# Altium schematic sheet cs301_Team01_Schematic_Sensor.SchDoc: Sensor Processing
size A4; Date: 06/08/2023; DrawnBy: Viktor Neshikj; Revision: 1.0; SheetNumber: 2; SheetTotal: 2
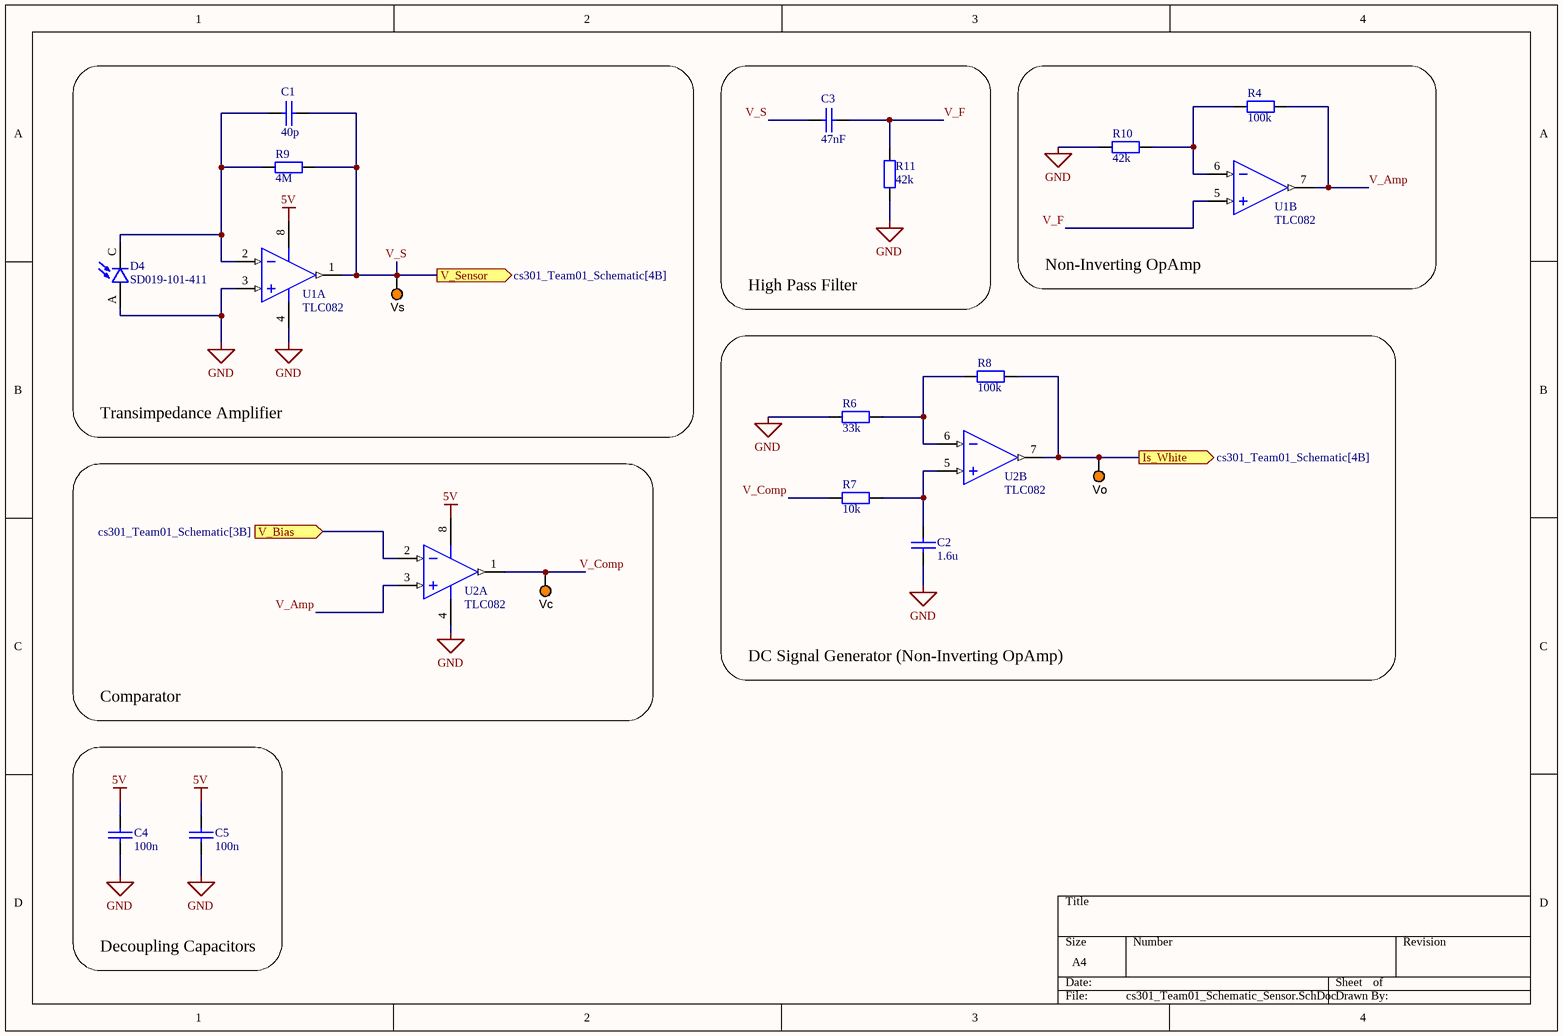
[diagram p0: cs301_Team01_Schematic_Sensor.SchDoc]

## Parts
C1  40p  [0805 CAP]
C2  1.6u  [0805 CAP]
C3  47nF  [0805 CAP]
C4  100n  [0805 CAP]
C5  100n  [0805 CAP]
D4  SD019-101-411  [XDCR_TEMD7000X01]
R4  100k  [0805 RES]
R6  33k  [0805 RES]
R7  10k  [0805 RES]
R8  100k  [0805 RES]
R9  4M  [0805 RES]
R10  42k  [0805 RES]
R11  42k  [0805 RES]
U1  TLC082  [SO - 8]  (parts A,B of 2)
U2  TLC082  [SO - 8]  (parts A,B of 2)
Vc  5003  [TP_TH]  (value not drawn)
Vo  5003  [TP_TH]  (value not drawn)
Vs  5003  [TP_TH]  (value not drawn)

## Blocks framed on the sheet
Transimpedance Amplifier: C1 D4 R9 U1 Vs
High Pass Filter: C3 R11
Non-Inverting OpAmp: R4 R10 U1
DC Signal Generator (Non-Inverting OpAmp): C2 R6-R8 U2 Vo
Comparator: U2 Vc
Decoupling Capacitors: C4 C5

## Ports
Is_White (out, see cs301_Team01_Schematic[4B]), V_Bias (in, see cs301_Team01_Schematic[3B]), V_Sensor (out, see cs301_Team01_Schematic[4B])

## Nets
5V: C4.1 C5.1 U1.8(VDD) U2.8(VDD)
GND: C2.1 C4.2 C5.2 D4.A R6.2 R10.1 R11.1 U1.3(VINA+) U1.4(VSS) U2.4(VSS)
Is_White: R8.1 U2.7(VOUTA) Vo.1 ; port Is_White
V_Amp: R4.2 U1.7(VOUTA) U2.3(VINA+)
V_Bias: U2.2(VINA-) ; port V_Bias
V_Comp: R7.2 U2.1(VOUTA) Vc.1
V_F: C3.2 R11.2 U1.5(VINA+)
V_S: C1.2 C3.1 R9.2 U1.1(VOUTA) Vs.1 ; port V_Sensor
NetC1_1: C1.1 D4.C R9.1 U1.2(VINA-)
NetC2_2: C2.2 R7.1 U2.5(VINA+)
NetR4_1: R4.1 R10.2 U1.6(VINA-)
NetR6_1: R6.1 R8.2 U2.6(VINA-)

## Library data of the parts
C1-C5 = CerCap_SMT_0805: SMT ceramic capacitor 0805 size; Value: *
D4 = TEMD7000X01: Photodiode SD019-101-411; MF: Vishay Semiconductor; Price: None; Purchase-URL: https://pricing.snapeda.com/search/part/TEMD7000X01/?ref=eda; Value: *; Check_prices: https://www.snapeda.com/parts/TEMD7000X01/Vishay+Semiconductor+Opto+Division/view-part/?ref=eda; Package: 0805 Vishay; SnapEDA_Link: https://www.snapeda.com/parts/TEMD7000X01/Vishay+Semiconductor+Opto+Division/view-part/?ref=snap; Availability: In Stock; MP: TEMD7000X01
R4 R6-R11 = Res_SMT_0805: 0805 resistor; Published: 8-Jun-2000; LatestRevisionDate: 17-Jul-2002; LatestRevisionNote: Re-released for DXP Platform.; PackageReference: AXIAL-0.4; Publisher: Altium Limited; Value: *; ComponentLink1Description: https://nz.mouser.com/datasheet/2/315/AOA0000C304-1149620.pdf
U1 U2 = TLC082_SMT_SOIC8: IC OPAMP GP 10MHZ 8SOIC; Manufacturer: Texas Instruments; Manufacturer Part Number: TLC082CDR; Amplifier Type: General Purpose; Slew Rate: 19 V/µs; Current - Supply: 1.9mA; Voltage - Supply, Single/Dual (±): 4.5 V ~ 16 V, ±2.25 V ~ 8 V; Supplier 1: Digi-Key; RoHS: RoHS Compliant; Category: Integrated Circuits (ICs); Stock 1: 29765; Pricing 1: 1=3.44, 10=3.087, 100=2.4808, 500=2.03822, 1000=1.68881 (NZD); Packaging: Cut Tape (CT); Part Status: Active; Output Type: -; Operating Temperature: 0°C ~ 70°C; Mounting Type: Surface Mount; Package / Case: 8-SOIC (0.154", 3.90mm Width); Supplier Device Package: 8-SOIC; Base Part Number: TLC082; ComponentLink1URL: http://www.ti.com/lit/ds/symlink/tlc080a.pdf; ComponentLink1Description: http://www.ti.com/lit/ds/symlink/tlc080a.pdf; Supplier Part Number 1: 296-2421-1-ND
Vc Vo Vs = TestPoint: Test Point, Orange, 1-Pin THD, RoHS; Peak Reverse Current: 600 uA; Forward Current: 3 A; Max Surge Current: 80 A; Forward Voltage: 1.08 V; Max Operating Temperature: 150 degC; PackageReference: 5003; Pins: 2; ComponentLink2URL: http://keyelco.com/userAssets/file/M65p56.pdf; PackageDescription: 1-Pin Through Hole Device, Dia 2.54 mm; Weight: 0.01 lb; Diameter: 5.3 mm; Mount: Through Hole; Package Quantity: 500; Packaging: Bulk; Min Operating Temperature: -65 degC; ComponentLink1Description: Manufacturer URL; Height: 0.25 inch; ComponentLink1URL: http://www.keyelco.com/; ComponentLink2Description: Datasheet; Width: 0.25 inch; REACH SVHC: No SVHC; RoHSCompliant: true; Radiation Hardening: No; Length: 9.5 mm; DatasheetVersion: Jun-15